# Altium schematic sheet 3V3.SchDoc
size A; SheetNumber: 2
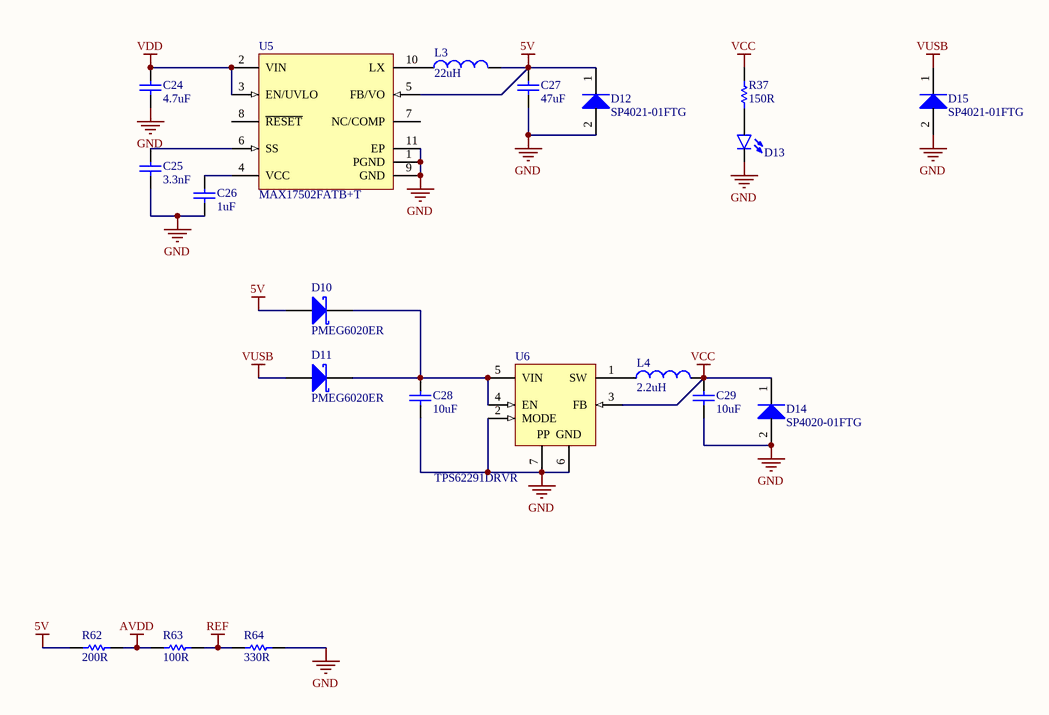
[diagram p0: 3V3.SchDoc]

## Parts
C24  value 4.7uF  [C1210[3225X200]]  (hidden comment: 4.7uF 100V 1210)
C25  value 3.3nF  [C0402[1005X55]]  (hidden comment: 3.3nF 50V 0402)
C26  value 1uF  [C0402[1005X55]]  (hidden comment: 1uF 6.3V 0402)
C27  value 47uF  [C1210[3225X250]]  (hidden comment: 47uF 6.3V 1210)
C28  value 10uF  [C0402[1005X55]]  (hidden comment: 10uF 6.3V 0402)
C29  value 10uF  [C0402[1005X55]]  (hidden comment: 10uF 6.3V 0402)
D10  PMEG6020ER  [SOD-123]
D11  PMEG6020ER  [SOD-123]
D12  SP4021-01FTG  [SOD-323]
D13  LED_0603_GREEN_5mA  [LED0603]  (value not drawn)
D14  SP4020-01FTG  [SOD323]
D15  SP4021-01FTG  [SOD-323]
L3  value 22uH  [SDR0604]
L4  2.2uH  [IND0805]
R37  value 150R  [R0402[1005]]  (hidden comment: 150R 1% 0402)
R62  value 200R  [R0603[1608]]  (hidden comment: 200R 1% 0603)
R63  value 100R  [R0603[1608]]  (hidden comment: 100R 1% 0603)
R64  value 330R  [R0603[1608]]  (hidden comment: 330R 1% 0603)
U5  MAX17502FATB+T  [TDFN-10-EP]
U6  TPS62291DRVR  [WSON-6]

## Nets
5V: C27.2 D10.2(A) D12.1(K) L3.2 R62.1 U5.5(FB/VO)
AVDD: R62.2 R63.1
GND: C24.1 C25.1 C26.1 C27.1 C28.1 C29.1 D12.2(A) D13.C D14.2(A) D15.2(A) R64.2 U5.1(PGND) U5.9(GND) U5.11(EP) U6.2(MODE) U6.6(GND) U6.7(EP)
REF: R63.2 R64.1
VCC: C29.2 D14.1(K) L4.2 R37.2 U6.3(FB)
VDD: C24.2 U5.2(VIN) U5.3(EN/UVLO)
VUSB: D11.2(A) D15.1(K)
NetC25_2: C25.2 U5.6(SS)
NetC26_2: C26.2 U5.4(VCC)
NetC28_2: C28.2 D10.1(K) D11.1(K) U6.4(EN) U6.5(VIN)
NetD13_A: D13.A R37.1
NetL3_1: L3.1 U5.10(LX)
NetL4_1: L4.1 U6.1(SW)

Not connected (* = marked no-connect by the designer): U5 7(NC/COMP) 8(~{RESET})

## Notes on the sheet
- (in symbol TPS62291DRVR) PP

## Library data of the parts
C24 = CAP_4.7uF_100V_1210_10%: 4.7uF 100V 10% 1210 (3225 Metric); PartNumber: GRJ32DC72A475KE11L; Manufacturer: Murata; Tolerance: 10%; Mounting Technology: Surface Mount; PackageReference: 1210; PackageDescription: 1210 (3225 Metric); Voltage: 100V
C25 = CAP_3.3nF_50V_0402_10%: 3.3nF 50V 10% 0402 (1005 Metric); PartNumber: GRM155R71H332KA01D; Manufacturer: Murata; Tolerance: 10%; Mounting Technology: Surface Mount; PackageReference: 0402; PackageDescription: 0402 (1005 Metric); Voltage: 50V
C26 = CAP_1uF_6.3V_0402_10%: 1uF 6.3V 10% 0402 (1005 Metric); PartNumber: GRM155R70J105KA12D; Manufacturer: Murata; Tolerance: 10%; Mounting Technology: Surface Mount; PackageReference: 0402; PackageDescription: 0402 (1005 Metric); Voltage: 6.3V
C27 = CAP_47uF_6.3V_1210_10%: 47uF 6.3V 10% 1210 (3225 Metric); PartNumber: GRM32ER70J476KE20L; Manufacturer: Murata; Tolerance: 10%; Mounting Technology: Surface Mount; PackageReference: 1210; PackageDescription: 1210 (3225 Metric); Voltage: 6.3V
C28 C29 = CAP_10uF_6.3V_0402_20%: 10uF 6.3V 20% 0402 (1005 Metric); PartNumber: GRM155R60J106ME44D; Manufacturer: Murata; Tolerance: 20%; Mounting Technology: Surface Mount; PackageReference: 0402; PackageDescription: 0402 (1005 Metric); Voltage: 6.3V
D10 D11 = PMEG6020ER: PartNumber: PMEG6020ER,115; Manufacturer: NXP Semiconductors; PackageReference: SOD-123W; PackageDescription: SOD, 2-Leads, Body 2.69x1.6mm; Mounting Technology: Surface Mount
D12 D15 = SP4021-01FTG: Manufacturer: Littelfuse; PartNumber: SP4021-01FTG; PackageReference: SOD-323-2; Mounting Technology: Surface Mount
D13 = LED_0603_GREEN_5mA: PartNumber: LTST-C193TGKT-5A; Manufacturer: Lite-On Inc.; PackageReference: 0603; PackageDescription: 0603 (1608 Metric); Mounting Technology: Surface Mount
D14 = SP4020-01FTG: Manufacturer: Littelfuse; PartNumber: SP4020-01FTG; PackageReference: SOD-323-2; Mounting Technology: Surface Mount
L3 = SDR0604-220YL: 22uH 30% 1.1A 0604; Manufacturer: Bourns; PartNumber: SDR0604-220YL; PackageReference: SDR0604; Mounting Technology: Surface Mount
L4 = IND_2.2uH_1.7A_0805_20%: 2.2uH 20% 1.7A 0805; PartNumber: LQM21PN2R2MGHL; Manufacturer: Murata; PackageReference: 0805; PackageDescription: 0805 (2012 metric); Value: 2.2uH; Mounting Technology: Surface Mount; Current: 1.7A
R37 = RES_150R_0402_1%: 150R 0.063W 1% 0402 (1005 Metric); Manufacturer: KOA Speer; PartNumber: RK73H1ETTP1500F; Power: 0.063W; Tolerance: 1%; Mounting Technology: Surface Mount; PackageReference: 0402; PackageDescription: 0402 (1005 Metric); ComponentLink1Description: Datasheet; ComponentLink1URL: http://www.koaspeer.com/catimages/Products/RK73H/RK73H.pdf
R62 = RES_200R_0603_1%: 200R 0.25W 1% 0603 (1005 Metric); Manufacturer: Vishay / Dale; Tolerance: 1%; Power: 0.25W; Mounting Technology: Surface Mount; PackageReference: 0603; PackageDescription: 0603 (1608 Metric); ComponentLink1Description: Datasheet; ComponentLink1URL: http://www.vishay.com/docs/20043/crcwhpe3.pdf
R63 = RES_100R_0603_1%: 100R 0.25W 1% 0603 (1005 Metric); Manufacturer: Vishay / Dale; Tolerance: 1%; Power: 0.25W; Mounting Technology: Surface Mount; PackageReference: 0603; PackageDescription: 0603 (1608 Metric); ComponentLink1Description: Datasheet; ComponentLink1URL: http://www.vishay.com/docs/20043/crcwhpe3.pdf
R64 = RES_330R_0603_1%: 330R 0.25W 1% 0603 (1005 Metric); Manufacturer: Vishay / Dale; Tolerance: 1%; Power: 0.25W; Mounting Technology: Surface Mount; PackageReference: 0603; PackageDescription: 0603 (1608 Metric); ComponentLink1Description: Datasheet; ComponentLink1URL: http://www.vishay.com/docs/20043/crcwhpe3.pdf
U5 = MAX17502FATB+T: Ultra-Small, High-Efficiency, Synchronous Step-Down DC-DC Converter, 4.5 to 60 V, 1 A, -40 to 125 degC, 10-Pin TDFN (T1032N+1), RoHS, Tape and Reel; Manufacturer: Maxim Integrated; Mounting Technology: Surface Mount; PartNumber: MAX17502FATB+T; PackageReference: TDFN-10-EP
U6 = TPS62291DRVR: Voltage Regulators - Switching Regulators 2.25MHz 1A Step-Down Cnvrtr 3.3V Output; Manufacturer: Texas Instruments; PartNumber: TPS62291DRVR; PackageReference: WSON-6; PackageDescription: SON, 6-Leads, Body 2x2mm, Pitch 0.65mm, Thermal Pad 1.6x1mm, TI Recommended; Mounting Technology: Surface Mount